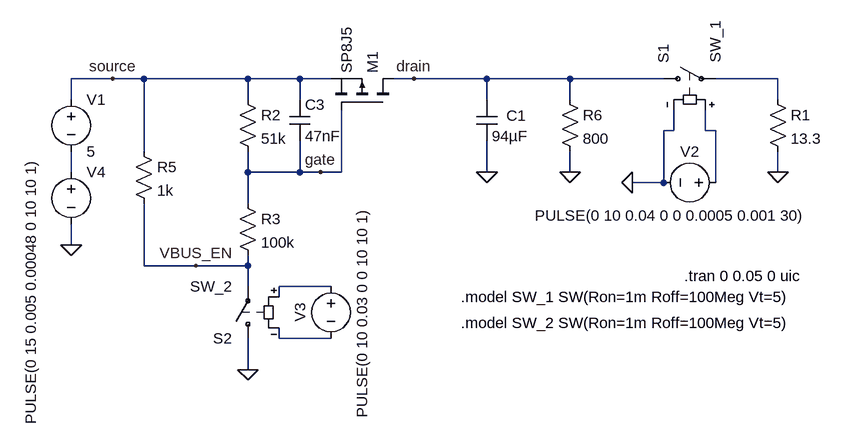
[diagram p0: schematic LED-Switch.asc]
LED-Switch.asc, the LTspice schematic file:
Version 4
SHEET 1 888 720
WIRE -432 160 -496 160
WIRE -384 160 -432 160
WIRE -224 160 -384 160
WIRE -144 160 -224 160
WIRE -96 160 -144 160
WIRE 32 160 0 160
WIRE 144 160 32 160
WIRE 272 160 144 160
WIRE 416 160 272 160
WIRE 592 160 496 160
WIRE -496 192 -496 160
WIRE -224 192 -224 160
WIRE -144 192 -144 160
WIRE 144 192 144 160
WIRE 272 192 272 160
WIRE 592 192 592 160
WIRE 432 240 432 208
WIRE 432 240 416 240
WIRE 480 240 480 208
WIRE 496 240 480 240
WIRE -384 272 -384 160
WIRE -496 304 -496 272
WIRE -224 304 -224 272
WIRE -144 304 -144 256
WIRE -144 304 -224 304
WIRE -112 304 -144 304
WIRE -80 304 -80 208
WIRE -80 304 -112 304
WIRE 144 304 144 256
WIRE 272 304 272 272
WIRE 592 304 592 272
WIRE 416 320 416 240
WIRE 416 320 368 320
WIRE 496 320 496 240
WIRE -224 352 -224 304
WIRE -496 416 -496 384
WIRE -384 448 -384 352
WIRE -304 448 -384 448
WIRE -224 448 -224 432
WIRE -224 448 -304 448
WIRE -224 480 -224 448
WIRE -96 480 -176 480
WIRE -176 496 -176 480
WIRE -176 560 -176 544
WIRE -96 560 -176 560
WIRE -224 608 -224 560
FLAG 592 304 0
FLAG 368 320 0
FLAG 144 304 0
FLAG -224 608 0
FLAG 272 304 0
FLAG -112 304 gate
FLAG -304 448 VBUS_EN
FLAG -496 416 0
FLAG -432 160 source
FLAG 32 160 drain
SYMBOL cap 128 192 R0
WINDOW 0 46 25 Left 2
SYMATTR InstName C1
SYMATTR Value 94µF
SYMBOL voltage -496 176 R0
WINDOW 123 0 0 Left 0
WINDOW 39 0 0 Left 0
SYMATTR InstName V1
SYMATTR Value 5
SYMBOL sw 400 160 R270
SYMATTR InstName S1
SYMATTR Value SW_1
SYMBOL voltage 512 320 R90
WINDOW 0 -32 56 VBottom 2
WINDOW 3 35 85 VTop 2
WINDOW 123 0 0 Left 0
WINDOW 39 0 0 Left 0
SYMATTR InstName V2
SYMATTR Value PULSE(0 10 0.04 0 0 0.0005 0.001 30)
SYMBOL res 576 176 R0
SYMATTR InstName R1
SYMATTR Value 13.3
SYMBOL pmos 0 208 M270
SYMATTR InstName M1
SYMATTR Value SP8J5
SYMBOL res -240 176 R0
SYMATTR InstName R2
SYMATTR Value 51k
SYMBOL res -240 336 R0
SYMATTR InstName R3
SYMATTR Value 100k
SYMBOL sw -224 576 R180
SYMATTR InstName S2
SYMATTR Value SW_2
SYMBOL voltage -96 464 R0
WINDOW 0 -32 56 VBottom 2
WINDOW 3 32 56 VTop 2
WINDOW 123 0 0 Left 0
WINDOW 39 0 0 Left 0
SYMATTR InstName V3
SYMATTR Value PULSE(0 10 0.03 0 0 10 10 1)
SYMBOL res -400 256 R0
SYMATTR InstName R5
SYMATTR Value 1k
SYMBOL res 256 176 R0
SYMATTR InstName R6
SYMATTR Value 800
SYMBOL cap -160 192 R0
SYMATTR InstName C3
SYMATTR Value 47nF
SYMBOL voltage -496 288 R0
WINDOW 3 -62 -7 VRight 2
WINDOW 123 0 0 Left 0
WINDOW 39 0 0 Left 0
SYMATTR Value PULSE(0 15 0.005 0.00048 0 10 10 1)
SYMATTR InstName V4
TEXT 448 464 Left 2 !.tran 0 0.05 0 uic
TEXT 104 496 Left 2 !.model SW_1 SW(Ron=1m Roff=100Meg Vt=5)
TEXT 104 536 Left 2 !.model SW_2 SW(Ron=1m Roff=100Meg Vt=5)

The netlist it stands for:
* LED-Switch.asc
C1 drain 0 94µF
V1 source N003 5
S1 drain N001 N002 0 SW_1
V2 N002 0 PULSE(0 10 0.04 0 0 0.0005 0.001 30)
R1 N001 0 13.3
M1 drain gate source source SP8J5
R2 source gate 51k
R3 gate VBUS_EN 100k
S2 0 VBUS_EN N004 N005 SW_2
V3 N004 N005 PULSE(0 10 0.03 0 0 10 10 1)
R5 source VBUS_EN 1k
R6 drain 0 800
C3 source gate 47nF
V4 N003 0 PULSE(0 15 0.005 0.00048 0 10 10 1)
.model NMOS NMOS
.model PMOS PMOS
.lib standard.mos
.tran 0 0.05 0 uic
.model SW_1 SW(Ron=1m Roff=100Meg Vt=5)
.model SW_2 SW(Ron=1m Roff=100Meg Vt=5)
.backanno
.end

* Results of the author's LTspice run, read from the files saved beside the schematic
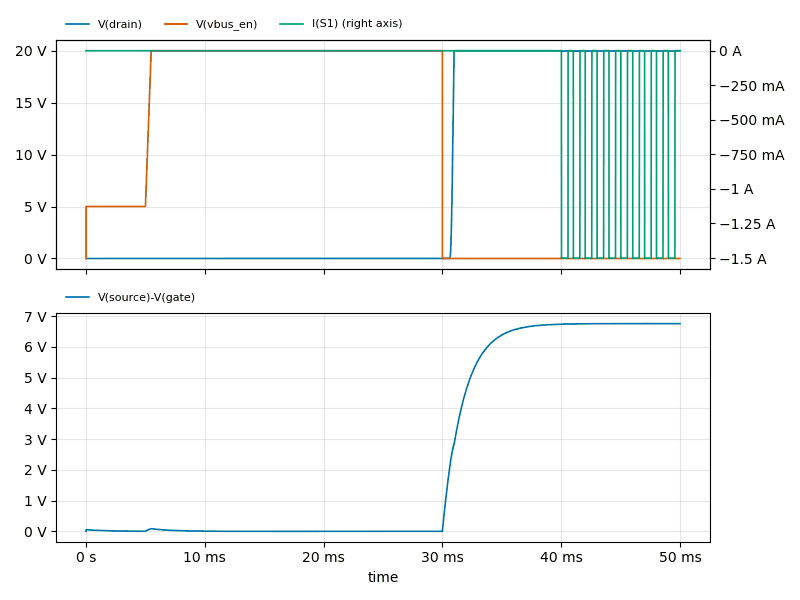
[diagram p1: Transient Analysis of LED-Switch.asc, plotted from the saved traces]
* Transient Analysis, 1 run:
*   V(drain): min 0 V, max 20 V, average 7.654 V, rms 12.35 V, last 20 V
*   V(vbus_en): min 0 V, max 20 V, average 10.43 V, rms 14.15 V, last 20.13 µV
*   I(S1): min -1.504 A, max 0 A, average -165.1 mA, rms 497.5 mA, last -200 nA
*   V(source)-V(gate): min 0 V, max 6.756 V, average 2.473 V, rms 3.985 V, last 6.754 V